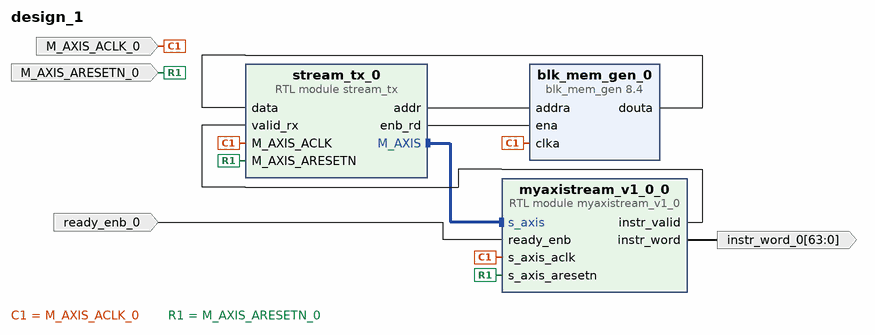
[diagram p0: block diagram of the top level]
# Vivado block design design_1, xc7z020clg484-1, Vivado 2025.1
create_bd_design design_1

create_bd_port -dir I -type clk M_AXIS_ACLK_0
create_bd_port -dir I -type rst M_AXIS_ARESETN_0
create_bd_port -dir O -from 63 -to 0 instr_word_0
create_bd_port -dir I ready_enb_0

create_bd_cell -type ip -vlnv xilinx.com:ip:blk_mem_gen:8.4 blk_mem_gen_0
set_property -dict [list \
  CONFIG.Coe_File ../../../../new/mem_init.coe \
  CONFIG.Fill_Remaining_Memory_Locations true \
  CONFIG.Load_Init_File true \
  CONFIG.Memory_Type Single_Port_ROM \
  CONFIG.Register_PortA_Output_of_Memory_Primitives false \
  CONFIG.Write_Width_A 64 \
  CONFIG.use_bram_block Stand_Alone \
] [get_bd_cells blk_mem_gen_0]
create_bd_cell -type module -reference myaxistream_v1_0 myaxistream_v1_0_0
create_bd_cell -type module -reference stream_tx stream_tx_0

# ---- connections ----

connect_bd_intf_net -intf_net stream_tx_0_S_AXIS [get_bd_intf_pins myaxistream_v1_0_0/s_axis] [get_bd_intf_pins stream_tx_0/M_AXIS]
connect_bd_net -net M_AXIS_ACLK_0_1 [get_bd_ports M_AXIS_ACLK_0] \
  [get_bd_pins myaxistream_v1_0_0/s_axis_aclk] [get_bd_pins blk_mem_gen_0/clka] [get_bd_pins stream_tx_0/M_AXIS_ACLK]
connect_bd_net -net M_AXIS_ARESETN_0_1 [get_bd_ports M_AXIS_ARESETN_0] \
  [get_bd_pins myaxistream_v1_0_0/s_axis_aresetn] [get_bd_pins stream_tx_0/M_AXIS_ARESETN]
connect_bd_net [get_bd_pins blk_mem_gen_0/douta] [get_bd_pins stream_tx_0/data]
connect_bd_net [get_bd_pins myaxistream_v1_0_0/instr_valid] [get_bd_pins stream_tx_0/valid_rx]
connect_bd_net [get_bd_pins myaxistream_v1_0_0/instr_word] [get_bd_ports instr_word_0]
connect_bd_net -net ready_enb_0_1 [get_bd_ports ready_enb_0] [get_bd_pins myaxistream_v1_0_0/ready_enb]
connect_bd_net [get_bd_pins stream_tx_0/addr] [get_bd_pins blk_mem_gen_0/addra]
connect_bd_net [get_bd_pins stream_tx_0/enb_rd] [get_bd_pins blk_mem_gen_0/ena]

validate_bd_design
save_bd_design
